# EAGLE design d11_micro_usb_std (EAGLE 7.3.0)
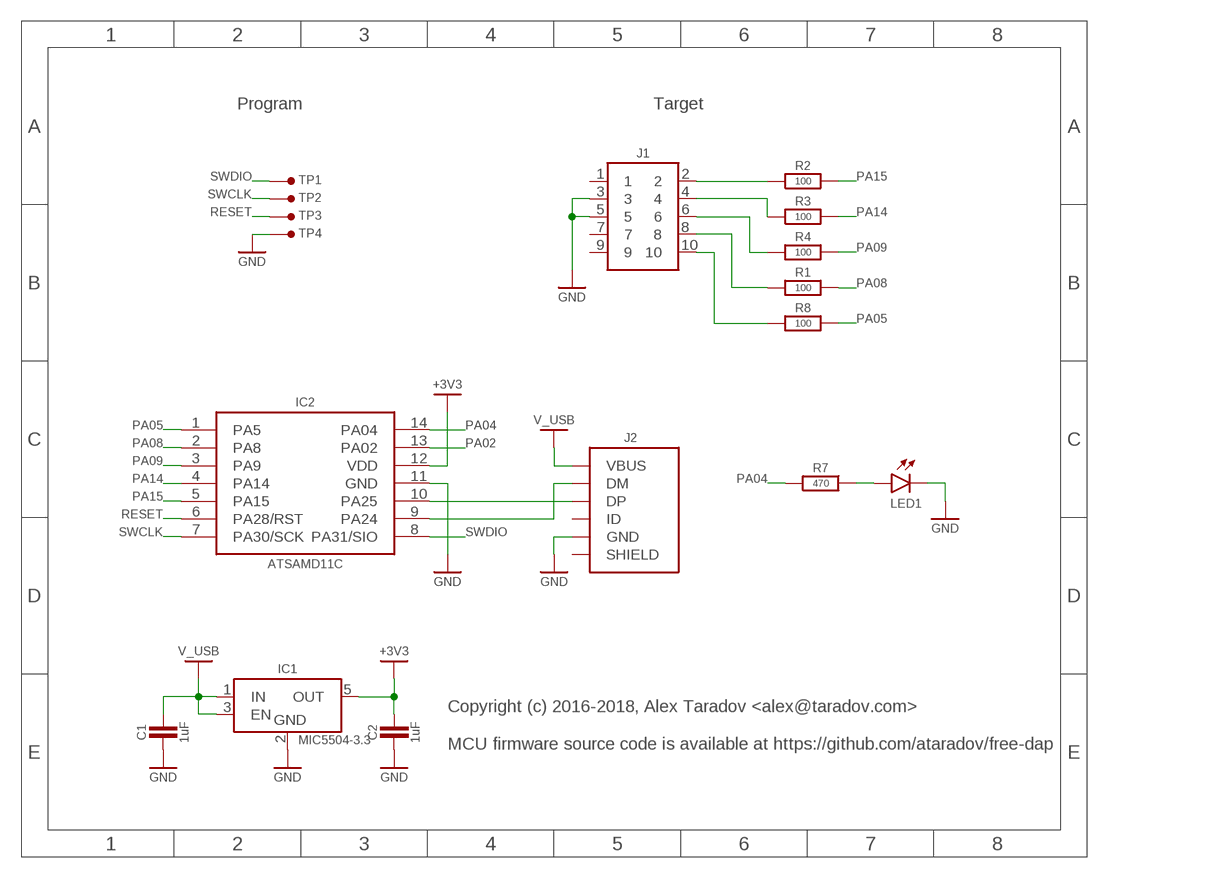
[diagram p0: schematic, sheet 1]

## Parts
C1  1uF  C-0603  [SMD0603]
C2  1uF  C-0603  [SMD0603]
IC1  MIC5504-3.3  MIC5504-SOT23-5  [SOT23-5]
IC2  ATSAMD11C  [SO-14]
J1  HEADER-5X2-TH-1.27  [HEADER-5X2-1.27MM]
J2  USB-B-MICRO-SMT  [USB-B-MICRO-SMT-SHELL-TH]
LED1  LED_SMDLED_0603  [SMD0603]
R1  100  R-0603  [SMD0603]
R2  100  R-0603  [SMD0603]
R3  100  R-0603  [SMD0603]
R4  100  R-0603  [SMD0603]
R7  470  R-0603  [SMD0603]
R8  100  R-0603  [SMD0603]
TP1  SIO  TEST-POINT-1.27MM  [TP-1.27MM]
TP2  TEST-POINT-1.27MM  [TP-1.27MM]
TP3  TEST-POINT-1.27MM  [TP-1.27MM]
TP4  TEST-POINT-1.27MM  [TP-1.27MM]

## Nets
+3V3: C2.2 IC1.5(OUT) IC2.12(VDD)
GND: C1.1 C2.1 IC1.2(GND) IC2.11(GND) J1.3 J1.5 J2.5(GND) LED1.2(C) TP4.1
N$1: IC2.9(PA24) J2.2(DM)
N$2: IC2.10(PA25) J2.3(DP)
N$3: LED1.1(A) R7.2
N$5: J1.2 R2.1
N$9: J1.4 R3.1
N$10: J1.6 R4.1
N$11: J1.8 R1.1
N$12: J1.10 R8.1
PA02: IC2.13(PA02)
PA04: IC2.14(PA04) R7.1
PA05: IC2.1(PA5) R8.2
PA08: IC2.2(PA8) R1.2
PA09: IC2.3(PA9) R4.2
PA14: IC2.4(PA14) R3.2
PA15: IC2.5(PA15) R2.2
RESET: IC2.6(PA28/RST) TP3.1
SWCLK: IC2.7(PA30/SCK) TP2.1
SWDIO: IC2.8(PA31/SIO) TP1.1
V_USB: C1.2 IC1.1(IN) IC1.3(EN) J2.1(VBUS)
Unconnected: J1.1 J1.7 J1.9 J2.4(ID) J2.M1(SHIELD) J2.M2(SHIELD) J2.M3(SHIELD) J2.M4(SHIELD)

## Notes on the sheet
- Program | Target
- Copyright (c) 2016-2018, Alex Taradov <alex@taradov.com>
  
  MCU firmware source code is available at https://github.com/ataradov/free-dap

## Library data of the parts
C1 C2 = ataradov_rlc:C
IC1 = ataradov_vreg:MIC5504: LM1117 voltage regulator
IC2 = ataradov_mcu:ATSAMD11C
J1 = ataradov_conn:HEADER-5X2
J2 = ataradov_conn:USB-B-MICRO
LED1 = ataradov_led:LED_SMD: SMD_LED
R1-R4 R7 R8 = ataradov_rlc:R
TP1-TP4 = ataradov_misc:TEST-POINT: Test Point

## Board
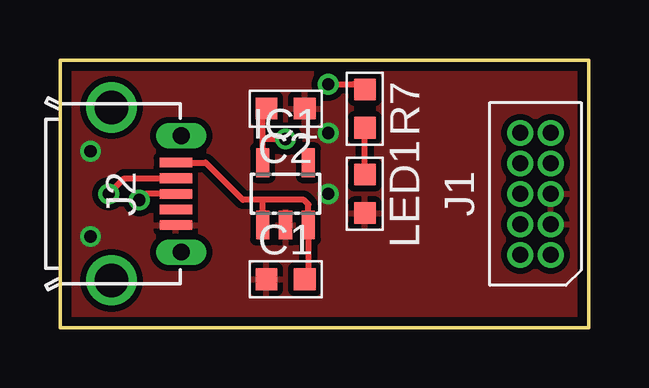
[diagram p1: board, top side]
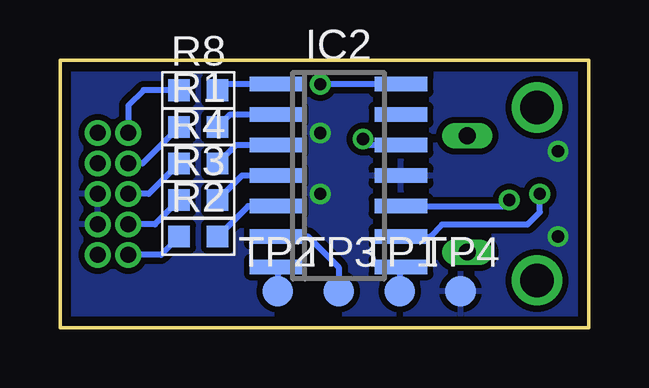
[diagram p2: board, bottom side, seen from below]

Size 22.02 x 11.17 mm. Coordinates in mm from the lower left corner, seen from the top.
Outline: 0,0 22.02,0 22.02,11.17 0,11.17 0,0
Copper layers (1*16): Top 0.0356mm / dielectric 1.5011mm / Bottom 0.0356mm
Design rules "OSHPark *": minimum track width 6mil, minimum drill 13mil, track to track 6mil, track to pad 6mil, pad to pad 6mil, via to via 6mil, smd to smd 6mil, copper to edge 15mil, drill to drill 6mil, minimum pad ring 7mil, minimum via ring 7mil, stop-mask expansion 3mil, vias tented up to drill 100mil, thermal gap 10mil

### Footprints (pad centres in the part's own frame; a part is rotated, then mirrored left to right if it is on the bottom)
SMD0603 = smd 0.9 x 0.9: 1 -0.8,0; 2 0.8,0
SOT23-5 = smd 0.55 x 1.2: 1 -0.95,-1.3; 2 0,-1.3; 3 0.95,-1.3; 4 0.95,1.3; 5 -0.95,1.3
SO-14 = smd 0.6 x 2.2: 1 -3.81,-2.6; 2 -2.54,-2.6; 3 -1.27,-2.6; 4 0,-2.6; 5 1.27,-2.6; 6 2.54,-2.6; 7 3.81,-2.6; 8 3.81,2.6; 9 2.54,2.6; 10 1.27,2.6; 11 0,2.6; 12 -1.27,2.6; 13 -2.54,2.6; 14 -3.81,2.6
HEADER-5X2-1.27MM = drill 0.66 pad 1.067: 1 -2.54,-0.635; 2 -2.54,0.635; 3 -1.27,-0.635; 4 -1.27,0.635; 5 0,-0.635; 6 0,0.635; 7 1.27,-0.635; 8 1.27,0.635; 9 2.54,-0.635; 10 2.54,0.635
USB-B-MICRO-SMT-SHELL-TH = smd 1.35 x 0.4: 1 4.825,1.3; 2 4.825,0.65; 3 4.825,0; 4 4.825,-0.65; 5 4.825,-1.3 | drill 1.397: M1 2.15,-3.6; M2 2.15,3.6 | drill 0.7 long: M3 5.05,2.425; M4 5.05,-2.425
TP-1.27MM = smd 1.27 x 1.27: 1 0,0

### Placement (x,y rotation side)
C1  9.4,2.03 0 top
C2  9.4,9.14 180 top
IC1  9.4,5.59 0 top
IC2  10.41,6.35 270 bottom
J1  19.81,5.59 90 top
J2  0,5.59 0 top
LED1  12.7,5.59 270 top
R1  16.26,8.38 0 bottom
R2  16.26,3.81 0 bottom
R3  16.26,5.33 0 bottom
R4  16.26,6.86 0 bottom
R7  12.7,9.14 270 top
R8  16.26,9.91 0 bottom
TP1  7.87,1.52 0 bottom
TP2  12.95,1.52 0 bottom
TP3  10.41,1.52 0 bottom
TP4  5.33,1.52 0 bottom

### Tracks (layer width: path | path; a pad name or v marks a point on that pad's centre or on a via)
+3V3  (via drill 0.51 pad 0.25)
  Top 0.254: IC1.5 8.45,7.87 | 8.45,7.87 8.45,8.99 C2.2 | v9.4,7.87 8.45,7.87
  Bottom 0.254: IC2.12 9.14,7.62 v9.4,7.87
GND  (via drill 0.51 pad 0.25)
  other vias: 1.27,3.81 1.27,7.37 11.18,5.59 11.18,8.13
  pour Bottom (isolate 0.254): 0,11.18 22.1,11.18 22.1,0 0,0
  pour Top (isolate 0.254): 0,11.18 22.1,11.18 22.1,0 0,0
N$1  (via drill 0.51 pad 0.25)
  Top 0.254: v2.03,5.59 2.68,6.24 J2.2
  Bottom 0.254: IC2.9 6.6,3.81 6.1,4.32 2.54,4.32 2.03,4.83 v2.03,5.59
N$2  (via drill 0.51 pad 0.25)
  Top 0.254: J2.3 3.56,5.59 v3.3,5.33
  Bottom 0.254: IC2.10 3.56,5.08 v3.3,5.33
N$3
  Top 0.254: LED1.1 R7.2
N$5
  Bottom 0.254: R2.1 17.82,3.05 J1.2
N$9
  Bottom 0.254: R3.1 18.07,4.32 J1.4
N$10
  Bottom 0.254: R4.1 18.33,5.59 J1.6
N$11
  Bottom 0.254: R1.1 18.58,6.86 J1.8
N$12
  Bottom 0.254: R8.1 18.54,9.91 19.18,9.27 J1.10
PA04  (via drill 0.51 pad 0.25)
  Top 0.254: v11.18,10.16 12.23,10.16 R7.1
  Bottom 0.254: IC2.14 v11.18,10.16
PA05
  Bottom 0.254: IC2.1 15.2,10.16 R8.2
PA08
  Bottom 0.254: IC2.2 14.95,8.89 R1.2
PA09
  Bottom 0.254: IC2.3 14.69,7.62 R4.2
PA14
  Bottom 0.254: IC2.4 14.44,6.35 R3.2
PA15
  Bottom 0.254: IC2.5 14.19,5.08 R2.2
RESET
  Bottom 0.254: IC2.6 11.68,3.81 10.41,2.54 TP3.1
SWCLK
  Bottom 0.254: IC2.7 12.95,2.48 TP2.1
SWDIO
  Bottom 0.254: IC2.8 7.87,2.48 TP1.1
V_USB
  Top 0.254: C1.2 10.35,2.44 IC1.3 10.35,5.15 10.16,5.33 8.38,5.33 | 8.38,5.33 7.62,5.33 6.07,6.89 J2.1 | IC1.1 8.45,5.27 8.38,5.33

### Text on the board
tValues: AT | 1
bValues: 5/25/18